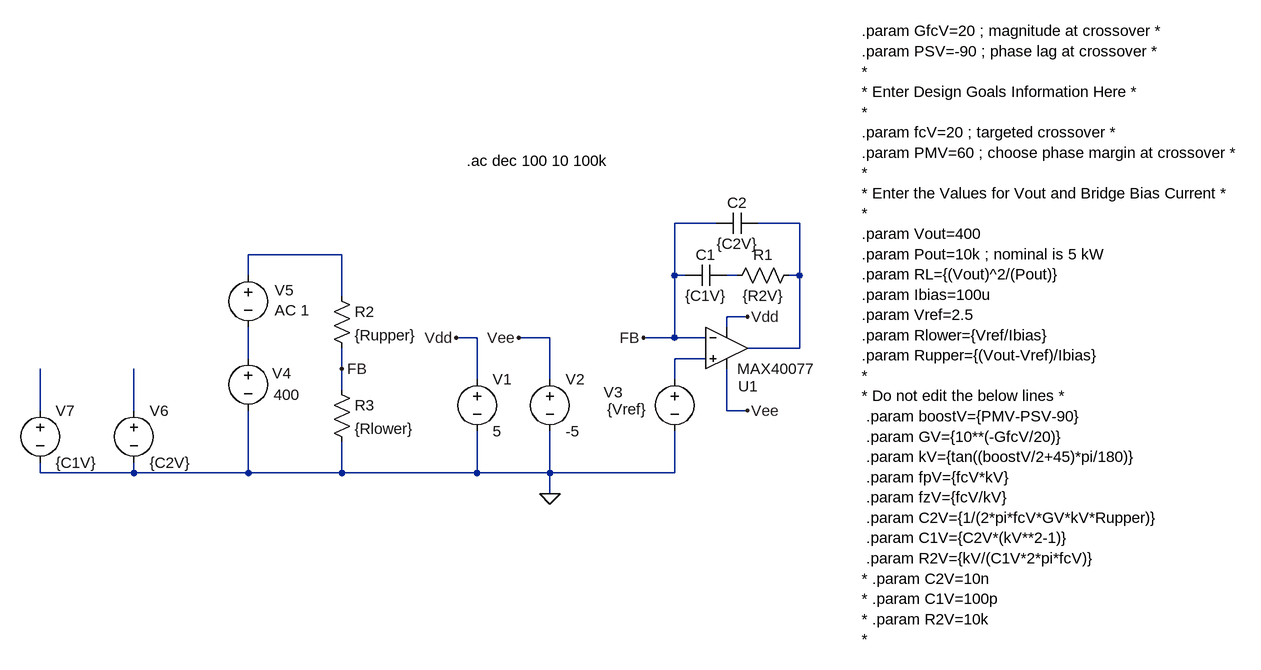
[diagram p0: schematic test type 2.asc]
test type 2.asc, the LTspice schematic file:
Version 4
SHEET 1 1204 680
WIRE 352 -32 288 -32
WIRE 480 -32 416 -32
WIRE -224 16 -368 16
WIRE -368 48 -368 16
WIRE 288 48 288 -32
WIRE 304 48 288 48
WIRE 384 48 368 48
WIRE 480 48 480 -32
WIRE 480 48 464 48
WIRE -224 80 -224 16
WIRE 400 112 368 112
WIRE 368 128 368 112
WIRE -16 144 -48 144
WIRE 96 144 48 144
WIRE 288 144 288 48
WIRE 288 144 240 144
WIRE 336 144 288 144
WIRE 480 160 480 48
WIRE 480 160 400 160
WIRE -368 176 -368 128
WIRE 336 176 288 176
WIRE -224 192 -224 160
WIRE -16 208 -16 144
WIRE 96 208 96 144
WIRE 288 208 288 176
WIRE -224 224 -224 192
WIRE -688 256 -688 192
WIRE -544 256 -544 192
WIRE 368 256 368 192
WIRE 400 256 368 256
WIRE -688 352 -688 336
WIRE -544 352 -544 336
WIRE -544 352 -688 352
WIRE -368 352 -368 256
WIRE -368 352 -544 352
WIRE -224 352 -224 304
WIRE -224 352 -368 352
WIRE -16 352 -16 288
WIRE -16 352 -224 352
WIRE 96 352 96 288
WIRE 96 352 -16 352
WIRE 288 352 288 288
WIRE 288 352 96 352
WIRE 96 384 96 352
FLAG -48 144 Vdd
FLAG 48 144 Vee
FLAG 240 144 FB
FLAG 400 256 Vee
FLAG 400 112 Vdd
FLAG 96 384 0
FLAG -224 192 FB
SYMBOL Opamps\\MAX40077 368 96 R0
WINDOW 0 18 123 Left 2
SYMATTR InstName U1
SYMBOL voltage -16 192 R0
WINDOW 123 0 0 Left 0
WINDOW 39 0 0 Left 0
SYMATTR InstName V1
SYMATTR Value 5
SYMBOL voltage 96 192 R0
WINDOW 123 0 0 Left 0
WINDOW 39 0 0 Left 0
SYMATTR InstName V2
SYMATTR Value -5
SYMBOL res 480 32 R90
WINDOW 0 0 56 VBottom 2
WINDOW 3 32 56 VTop 2
SYMATTR InstName R1
SYMATTR Value {R2V}
SYMBOL cap 368 32 R90
WINDOW 0 0 32 VBottom 2
WINDOW 3 32 32 VTop 2
SYMATTR InstName C1
SYMATTR Value {C1V}
SYMBOL cap 416 -48 R90
WINDOW 0 0 32 VBottom 2
WINDOW 3 32 32 VTop 2
SYMATTR InstName C2
SYMATTR Value {C2V}
SYMBOL voltage 288 192 M0
WINDOW 0 80 36 Left 2
WINDOW 3 43 62 Left 2
SYMATTR InstName V3
SYMATTR Value {Vref}
SYMBOL res -240 64 R0
SYMATTR InstName R2
SYMATTR Value {Rupper}
SYMBOL res -240 208 R0
SYMATTR InstName R3
SYMATTR Value {Rlower}
SYMBOL voltage -368 160 R0
WINDOW 0 37 39 Left 2
WINDOW 3 39 72 Left 2
SYMATTR InstName V4
SYMATTR Value 400
SYMBOL voltage -368 32 R0
WINDOW 0 41 39 Left 2
WINDOW 123 41 70 Left 2
WINDOW 39 0 0 Left 0
SYMATTR InstName V5
SYMATTR Value ""
SYMATTR Value2 AC 1
SYMBOL voltage -544 240 R0
WINDOW 123 0 0 Left 0
WINDOW 39 0 0 Left 0
SYMATTR InstName V6
SYMATTR Value {C2V}
SYMBOL voltage -688 240 R0
WINDOW 123 0 0 Left 0
WINDOW 39 0 0 Left 0
SYMATTR InstName V7
SYMATTR Value {C1V}
TEXT 576 -328 Left 2 !.param GfcV=20 ; magnitude at crossover *\n.param PSV=-90 ; phase lag at crossover *\n*\n* Enter Design Goals Information Here *\n*\n.param fcV=20 ; targeted crossover *\n.param PMV=60 ; choose phase margin at crossover *\n*\n* Enter the Values for Vout and Bridge Bias Current *\n*\n.param Vout=400\n.param Pout=10k ; nominal is 5 kW\n.param RL={(Vout)^2/(Pout)}\n.param Ibias=100u\n.param Vref=2.5\n.param Rlower={Vref/Ibias}\n.param Rupper={(Vout-Vref)/Ibias}\n*\n* Do not edit the below lines *\n .param boostV={PMV-PSV-90}\n .param GV={10**(-GfcV/20)}\n .param kV={tan((boostV/2+45)*pi/180)}\n .param fpV={fcV*kV}\n .param fzV={fcV/kV}\n .param C2V={1/(2*pi*fcV*GV*kV*Rupper)}\n .param C1V={C2V*(kV**2-1)}\n .param R2V={kV/(C1V*2*pi*fcV)}\n* .param C2V=10n\n* .param C1V=100p\n* .param R2V=10k\n*
TEXT -32 -128 Left 2 !.ac dec 100 10 100k

The netlist it stands for:
* test type 2.asc
XU1 N005 FB Vdd Vee N001 MAX40077  ; pins In+ In- V+ V- OUT
V1 Vdd 0 5
V2 Vee 0 -5
R1 N001 N003 {R2V}
C1 N003 FB {C1V}
C2 N001 FB {C2V}
V3 N005 0 {Vref}
R2 N002 FB {Rupper}
R3 FB 0 {Rlower}
V4 N004 0 400
V5 N002 N004 AC 1
V6 N007 0 {C2V}
V7 N006 0 {C1V}
.param GfcV=20 ; magnitude at crossover *
.param PSV=-90 ; phase lag at crossover *
*
* Enter Design Goals Information Here *
*
.param fcV=20 ; targeted crossover *
.param PMV=60 ; choose phase margin at crossover *
*
* Enter the Values for Vout and Bridge Bias Current *
*
.param Vout=400
.param Pout=10k ; nominal is 5 kW
.param RL={(Vout)^2/(Pout)}
.param Ibias=100u
.param Vref=2.5
.param Rlower={Vref/Ibias}
.param Rupper={(Vout-Vref)/Ibias}
*
* Do not edit the below lines *
 .param boostV={PMV-PSV-90}
 .param GV={10**(-GfcV/20)}
 .param kV={tan((boostV/2+45)*pi/180)}
 .param fpV={fcV*kV}
 .param fzV={fcV/kV}
 .param C2V={1/(2*pi*fcV*GV*kV*Rupper)}
 .param C1V={C2V*(kV**2-1)}
 .param R2V={kV/(C1V*2*pi*fcV)}
* .param C2V=10n
* .param C1V=100p
* .param R2V=10k
*
.ac dec 100 10 100k
.backanno
.end